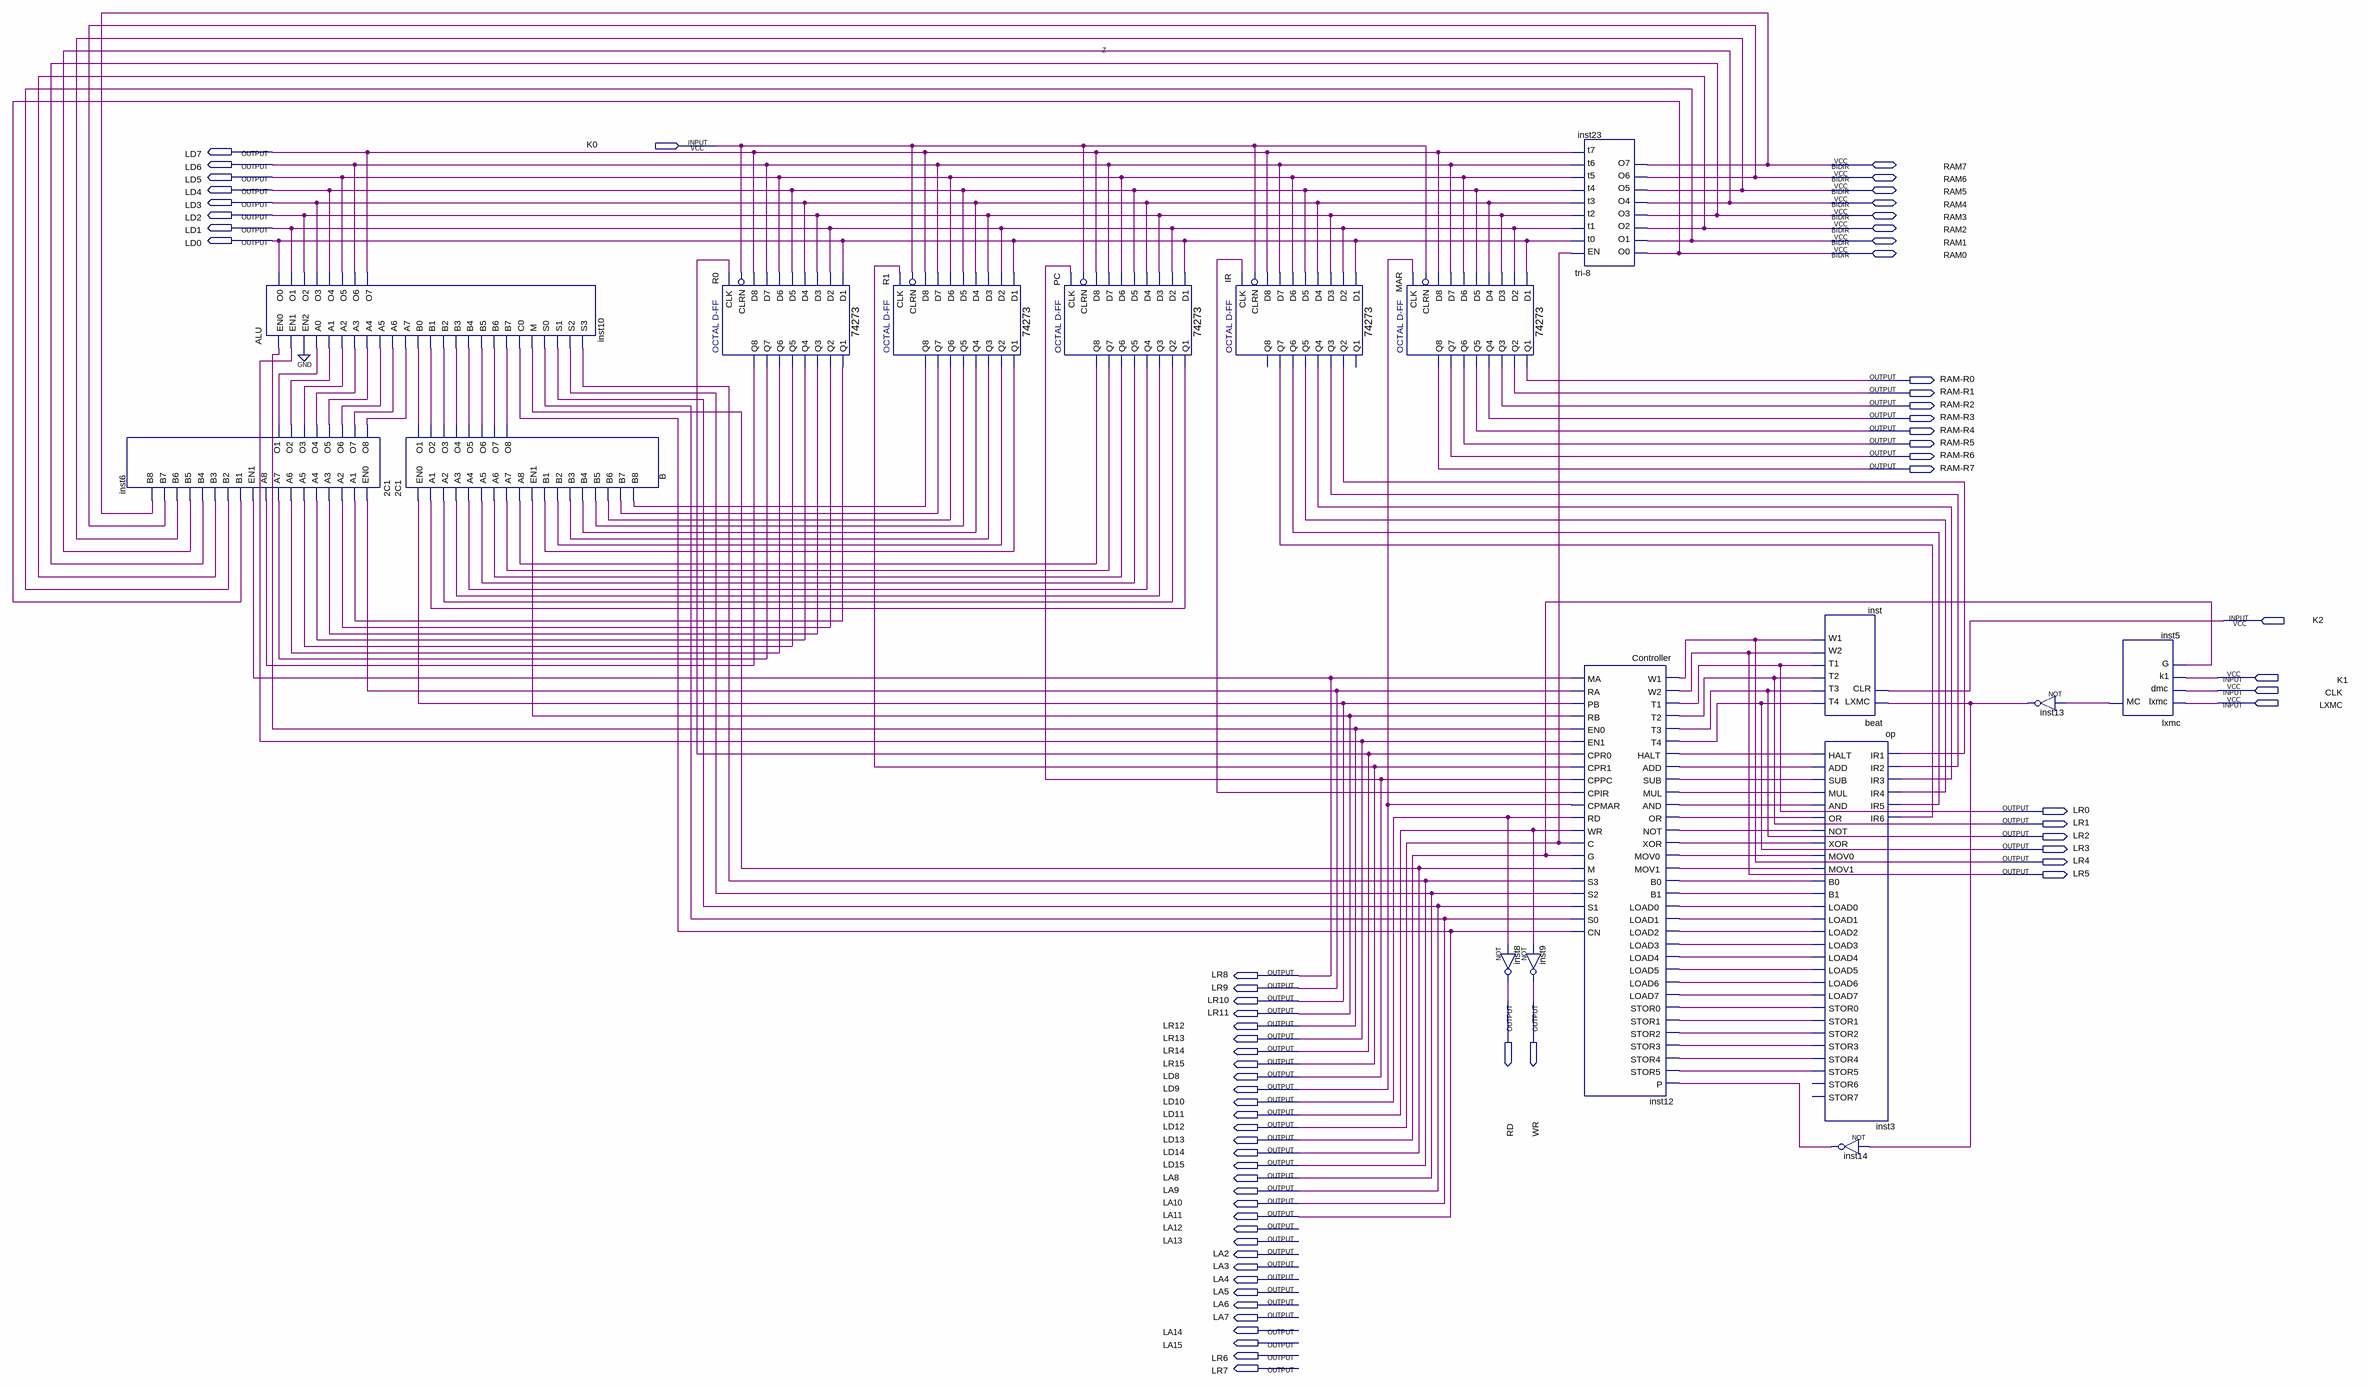
[diagram p0: schematic sheet]
// Quartus schematic hardwiring.bdf as structural Verilog: 17 symbols, 69 pins
module hardwiring (
  input  K0,
  input  K2,
  input  K1,
  input  CLK,
  input  LXMC,
  inout  RAM7,
  inout  RAM6,
  inout  RAM5,
  inout  RAM4,
  inout  RAM3,
  inout  RAM2,
  inout  RAM1,
  inout  RAM0,
  output LD7,
  output LD6,
  output LD5,
  output LD4,
  output LD3,
  output LD2,
  output LD1,
  output LD0,
  output \RAM-R0 ,
  output \RAM-R1 ,
  output \RAM-R2 ,
  output \RAM-R3 ,
  output \RAM-R4 ,
  output \RAM-R5 ,
  output \RAM-R6 ,
  output \RAM-R7 ,
  output LR0,
  output LR1,
  output LR2,
  output LR3,
  output LR4,
  output LR5,
  output LR8,
  output LR9,
  output LR10,
  output RD,
  output WR,
  output LR11,
  output LR12,
  output LR13,
  output LR14,
  output LR15,
  output LD8,
  output LD9,
  output LD10,
  output LD11,
  output LD12,
  output LD13,
  output LD14,
  output LD15,
  output LA8,
  output LA9,
  output LA10,
  output LA11,
  output LA12,
  output LA13,
  output LA2,
  output LA3,
  output LA4,
  output LA5,
  output LA6,
  output LA7,
  output LA14,
  output LA15,
  output LR6,
  output LR7
);

  wire B_o1, B_o2, B_o3, B_o4, B_o5, B_o6, B_o7, B_o8, inst3_add, inst3_and, inst3_b0, inst3_b1, inst3_halt,
       inst3_load0, inst3_load1, inst3_load2, inst3_load3, inst3_load4, inst3_load5, inst3_load6,
       inst3_load7, inst3_mov0, inst3_mov1, inst3_mul, inst3_not, inst3_or, inst3_stor0, inst3_stor1,
       inst3_stor2, inst3_stor3, inst3_stor4, inst3_stor5, inst3_sub, inst3_xor, inst5_mc, inst6_o1,
       inst6_o2, inst6_o3, inst6_o4, inst6_o5, inst6_o6, inst6_o7, inst6_o8, inst12_cpir, inst13_out,
       inst14_out, IR_q2, IR_q3, IR_q4, IR_q5, IR_q6, IR_q7, PC_q1, PC_q2, PC_q3, PC_q4, PC_q5, PC_q6, PC_q7,
       PC_q8, R0_q1, R0_q2, R0_q3, R0_q4, R0_q5, R0_q6, R0_q7, R0_q8, R1_q1, R1_q2, R1_q3, R1_q4, R1_q5,
       R1_q6, R1_q7, R1_q8;

  \2C1  inst6 (
    .EN0(LR9), .A1(R0_q1), .A2(R0_q2), .A3(R0_q3), .A4(R0_q4), .A5(R0_q5), .A6(R0_q6), .A7(R0_q7),
    .A8(R0_q8), .EN1(LR8), .B1(RAM0), .B2(RAM1), .B3(RAM2), .B4(RAM3), .B5(RAM4), .B6(RAM5), .B7(RAM6),
    .B8(RAM7), .O8(inst6_o8), .O7(inst6_o7), .O6(inst6_o6), .O5(inst6_o5), .O4(inst6_o4), .O3(inst6_o3),
    .O2(inst6_o2), .O1(inst6_o1));
  ALU inst10 (
    .EN0(LR12), .EN1(LR13), .EN2(1'b0), .A0(inst6_o1), .A1(inst6_o2), .A2(inst6_o3), .A3(inst6_o4),
    .A4(inst6_o5), .A5(inst6_o6), .A6(inst6_o7), .A7(inst6_o8), .B0(B_o1), .B1(B_o2), .B2(B_o3), .B3(B_o4),
    .B4(B_o5), .B5(B_o6), .B6(B_o7), .B7(B_o8), .C0(LA11), .M(LD14), .S0(LA10), .S1(LA9), .S2(LA8),
    .S3(LD15), .O0(LD0), .O1(LD1), .O2(LD2), .O3(LD3), .O4(LD4), .O5(LD5), .O6(LD6), .O7(LD7));
  \2C1  B (
    .EN0(LR10), .A1(PC_q1), .A2(PC_q2), .A3(PC_q3), .A4(PC_q4), .A5(PC_q5), .A6(PC_q6), .A7(PC_q7),
    .A8(PC_q8), .EN1(LR11), .B1(R1_q1), .B2(R1_q2), .B3(R1_q3), .B4(R1_q4), .B5(R1_q5), .B6(R1_q6),
    .B7(R1_q7), .B8(R1_q8), .O1(B_o1), .O2(B_o2), .O3(B_o3), .O4(B_o4), .O5(B_o5), .O6(B_o6), .O7(B_o7),
    .O8(B_o8));
  \74273  R0 (
    .D2(LD1), .D3(LD2), .D1(LD0), .D4(LD3), .D7(LD6), .D6(LD5), .D5(LD4), .D8(LD7), .CLK(LR14), .CLRN(K0),
    .Q4(R0_q4), .Q1(R0_q1), .Q2(R0_q2), .Q3(R0_q3), .Q6(R0_q6), .Q5(R0_q5), .Q7(R0_q7), .Q8(R0_q8));
  \74273  R1 (
    .D2(LD1), .D3(LD2), .D1(LD0), .D4(LD3), .D7(LD6), .D6(LD5), .D5(LD4), .D8(LD7), .CLK(LR15), .CLRN(K0),
    .Q4(R1_q4), .Q1(R1_q1), .Q2(R1_q2), .Q3(R1_q3), .Q6(R1_q6), .Q5(R1_q5), .Q7(R1_q7), .Q8(R1_q8));
  \74273  PC (
    .D2(LD1), .D3(LD2), .D1(LD0), .D4(LD3), .D7(LD6), .D6(LD5), .D5(LD4), .D8(LD7), .CLK(LD8), .CLRN(K0),
    .Q4(PC_q4), .Q1(PC_q1), .Q2(PC_q2), .Q3(PC_q3), .Q6(PC_q6), .Q5(PC_q5), .Q7(PC_q7), .Q8(PC_q8));
  \74273  IR (
    .D2(LD1), .D3(LD2), .D1(LD0), .D4(LD3), .D7(LD6), .D6(LD5), .D5(LD4), .D8(LD7), .CLK(inst12_cpir),
    .CLRN(K0), .Q4(IR_q4), .Q2(IR_q2), .Q3(IR_q3), .Q6(IR_q6), .Q5(IR_q5), .Q7(IR_q7));  // open: Q1, Q8
  \74273  MAR (
    .D2(LD1), .D3(LD2), .D1(LD0), .D4(LD3), .D7(LD6), .D6(LD5), .D5(LD4), .D8(LD7), .CLK(LD9), .CLRN(K0),
    .Q4(\RAM-R3 ), .Q1(\RAM-R0 ), .Q2(\RAM-R1 ), .Q3(\RAM-R2 ), .Q6(\RAM-R5 ), .Q5(\RAM-R4 ), .Q7(\RAM-R6 ),
    .Q8(\RAM-R7 ));
  not inst8 (RD, LD10);
  not inst9 (WR, LD11);
  \tri-8  inst23 (
    .EN(LD12), .t0(LD0), .t1(LD1), .t2(LD2), .t3(LD3), .t4(LD4), .t5(LD5), .t6(LD6), .t7(LD7), .O0(RAM0),
    .O1(RAM1), .O2(RAM2), .O3(RAM3), .O4(RAM4), .O5(RAM5), .O6(RAM6), .O7(RAM7));
  Controller inst12 (
    .W1(LR4), .W2(LR5), .T1(LR0), .T2(LR1), .T3(LR2), .T4(LR3), .HALT(inst3_halt), .ADD(inst3_add),
    .SUB(inst3_sub), .MUL(inst3_mul), .AND(inst3_and), .OR(inst3_or), .NOT(inst3_not), .XOR(inst3_xor),
    .MOV0(inst3_mov0), .MOV1(inst3_mov1), .B0(inst3_b0), .B1(inst3_b1), .LOAD0(inst3_load0),
    .LOAD1(inst3_load1), .LOAD2(inst3_load2), .LOAD3(inst3_load3), .LOAD4(inst3_load4), .LOAD5(inst3_load5),
    .LOAD6(inst3_load6), .LOAD7(inst3_load7), .STOR0(inst3_stor0), .STOR1(inst3_stor1), .STOR2(inst3_stor2),
    .STOR3(inst3_stor3), .STOR4(inst3_stor4), .STOR5(inst3_stor5), .P(inst14_out), .MA(LR8), .RA(LR9),
    .PB(LR10), .RB(LR11), .EN0(LR12), .EN1(LR13), .CPR0(LR14), .CPR1(LR15), .CPPC(LD8), .CPIR(inst12_cpir),
    .CPMAR(LD9), .RD(LD10), .WR(LD11), .C(LD12), .G(LD13), .M(LD14), .S3(LD15), .S2(LA8), .S1(LA9),
    .S0(LA10), .CN(LA11));
  beat inst (.LXMC(inst13_out), .CLR(K2), .T4(LR3), .T3(LR2), .T2(LR1), .T1(LR0), .W2(LR5), .W1(LR4));
  op inst3 (
    .IR1(IR_q2), .IR2(IR_q3), .IR3(IR_q4), .IR4(IR_q5), .IR5(IR_q6), .IR6(IR_q7), .HALT(inst3_halt),
    .ADD(inst3_add), .SUB(inst3_sub), .MUL(inst3_mul), .AND(inst3_and), .OR(inst3_or), .NOT(inst3_not),
    .XOR(inst3_xor), .MOV0(inst3_mov0), .MOV1(inst3_mov1), .B0(inst3_b0), .B1(inst3_b1), .LOAD0(inst3_load0),
    .LOAD1(inst3_load1), .LOAD2(inst3_load2), .LOAD3(inst3_load3), .LOAD4(inst3_load4), .LOAD5(inst3_load5),
    .LOAD6(inst3_load6), .LOAD7(inst3_load7), .STOR0(inst3_stor0), .STOR1(inst3_stor1), .STOR2(inst3_stor2),
    .STOR3(inst3_stor3), .STOR4(inst3_stor4), .STOR5(inst3_stor5));  // open: STOR6, STOR7
  not inst14 (inst14_out, inst13_out);
  not inst13 (inst13_out, inst5_mc);
  lxmc inst5 (.lxmc(LXMC), .dmc(CLK), .k1(K1), .G(LD13), .MC(inst5_mc));

  // Notes on the sheet:
  //   z
endmodule
